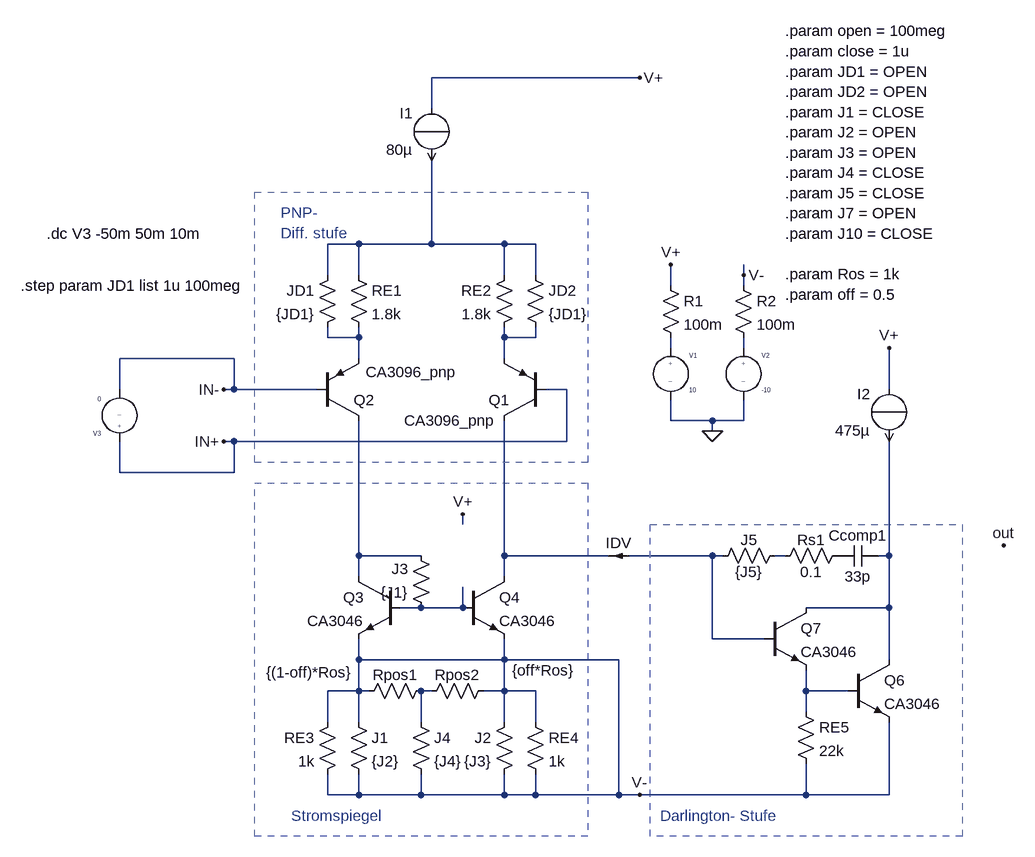
[diagram p0: schematic Diff+spiegel.asc]
Diff+spiegel.asc, the LTspice schematic file:
Version 4
SHEET 1 964 680
WIRE 112 -560 -208 -560
WIRE -208 -512 -208 -560
WIRE -320 -304 -368 -304
WIRE -208 -304 -208 -432
WIRE -208 -304 -320 -304
WIRE -96 -304 -208 -304
WIRE -48 -304 -96 -304
WIRE -368 -256 -368 -304
WIRE -320 -256 -320 -304
WIRE -96 -256 -96 -304
WIRE -48 -256 -48 -304
WIRE 272 -256 272 -272
WIRE 160 -240 160 -272
WIRE 272 -240 272 -256
WIRE -368 -160 -368 -176
WIRE -320 -160 -320 -176
WIRE -320 -160 -368 -160
WIRE -96 -160 -96 -176
WIRE -48 -160 -48 -176
WIRE -48 -160 -96 -160
WIRE 160 -144 160 -160
WIRE 272 -144 272 -160
WIRE -512 -128 -688 -128
WIRE -320 -128 -320 -160
WIRE -96 -128 -96 -160
WIRE -688 -80 -688 -128
WIRE -512 -80 -512 -128
WIRE -512 -80 -528 -80
WIRE -384 -80 -512 -80
WIRE 0 -80 -32 -80
WIRE 496 -80 496 -144
WIRE 160 -32 160 -64
WIRE 224 -32 160 -32
WIRE 272 -32 272 -64
WIRE 272 -32 224 -32
WIRE 224 -16 224 -32
WIRE -512 0 -528 0
WIRE 0 0 0 -80
WIRE 0 0 -512 0
WIRE -688 48 -688 0
WIRE -512 48 -512 0
WIRE -512 48 -688 48
WIRE -160 128 -160 112
WIRE -320 176 -320 -32
WIRE -224 176 -320 176
WIRE -96 176 -96 -32
WIRE 64 176 -96 176
WIRE 224 176 96 176
WIRE 240 176 224 176
WIRE 336 176 320 176
WIRE 496 176 496 0
WIRE 496 176 480 176
WIRE -320 208 -320 176
WIRE -96 208 -96 176
WIRE -224 256 -256 256
WIRE -160 256 -160 224
WIRE -160 256 -224 256
WIRE 496 256 496 176
WIRE 496 256 368 256
WIRE 224 304 224 176
WIRE 304 304 224 304
WIRE -320 336 -320 304
WIRE -96 336 -96 304
WIRE -96 336 -320 336
WIRE 80 336 -96 336
WIRE 496 336 496 256
WIRE -320 384 -320 336
WIRE -320 384 -368 384
WIRE -304 384 -320 384
WIRE -208 384 -224 384
WIRE -96 384 -96 336
WIRE -96 384 -128 384
WIRE -48 384 -96 384
WIRE 368 384 368 352
WIRE 432 384 368 384
WIRE 368 416 368 384
WIRE -368 432 -368 384
WIRE -320 432 -320 384
WIRE -224 432 -224 384
WIRE -96 432 -96 384
WIRE -48 432 -48 384
WIRE -368 544 -368 512
WIRE -320 544 -320 512
WIRE -320 544 -368 544
WIRE -224 544 -224 512
WIRE -224 544 -320 544
WIRE -96 544 -96 512
WIRE -96 544 -224 544
WIRE -48 544 -48 512
WIRE -48 544 -96 544
WIRE 80 544 80 336
WIRE 80 544 -48 544
WIRE 112 544 80 544
WIRE 368 544 368 496
WIRE 368 544 112 544
WIRE 496 544 496 432
WIRE 496 544 368 544
FLAG -160 112 V+
FLAG -528 -80 IN-
FLAG -528 0 IN+
FLAG 112 -560 V+
FLAG 112 544 V-
FLAG 224 -16 0
FLAG 160 -272 V+
FLAG 272 -256 V-
FLAG 496 -144 V+
FLAG 672 160 out
SYMBOL EIT_Semiconductors\\pnp -32 -32 R180
WINDOW 3 77 0 Left 2
SYMATTR Value CA3096_pnp
SYMATTR InstName Q1
SYMBOL EIT_Semiconductors\\pnp -384 -32 M180
WINDOW 3 75 75 Left 2
SYMATTR Value CA3096_pnp
SYMATTR InstName Q2
SYMBOL res -336 -272 R0
SYMATTR InstName RE1
SYMATTR Value 1.8k
SYMBOL res -80 -272 M0
SYMATTR InstName RE2
SYMATTR Value 1.8k
SYMBOL res -352 -272 M0
SYMATTR InstName JD1
SYMATTR Value {JD1}
SYMBOL res -64 -272 R0
SYMATTR InstName JD2
SYMATTR Value {JD1}
SYMBOL EIT_Semiconductors\\npn -256 208 M0
SYMATTR InstName Q3
SYMATTR Value CA3046
SYMBOL EIT_Semiconductors\\npn -160 208 R0
SYMATTR InstName Q4
SYMATTR Value CA3046
SYMBOL res -208 368 R90
WINDOW 0 7 56 VBottom 2
WINDOW 3 -28 188 VTop 2
SYMATTR InstName Rpos1
SYMATTR Value {(1-off)*Ros}
SYMBOL res -336 416 R0
SYMATTR InstName J1
SYMATTR Value {J2}
SYMBOL res -80 416 M0
SYMATTR InstName J2
SYMATTR Value {J3}
SYMBOL res -352 416 M0
SYMATTR InstName RE3
SYMATTR Value 1k
SYMBOL res -64 416 R0
SYMATTR InstName RE4
SYMATTR Value 1k
SYMBOL res -208 272 R180
WINDOW 0 36 76 Left 2
WINDOW 3 36 40 Left 2
SYMATTR InstName J3
SYMATTR Value {J1}
SYMBOL res -112 368 R90
WINDOW 0 7 56 VBottom 2
WINDOW 3 -31 -76 VTop 2
SYMATTR InstName Rpos2
SYMATTR Value {off*Ros}
SYMBOL res -240 416 R0
SYMATTR InstName J4
SYMATTR Value {J4}
SYMBOL source-I -208 -432 R180
WINDOW 0 29 73 Left 2
WINDOW 3 29 17 Left 2
WINDOW 123 0 0 Left 2
WINDOW 39 0 0 Left 2
SYMATTR InstName I1
SYMATTR Value 80µ
SYMBOL source-V 160 -160 R0
WINDOW 123 0 0 Left 2
WINDOW 39 0 0 Left 2
SYMATTR InstName V1
SYMATTR Value 10
SYMBOL source-V 272 -160 R0
WINDOW 123 0 0 Left 2
WINDOW 39 0 0 Left 2
SYMATTR InstName V2
SYMATTR Value -10
SYMBOL source-V -688 16 R180
WINDOW 123 0 0 Left 2
WINDOW 39 0 0 Left 2
SYMATTR InstName V3
SYMATTR Value 0
SYMBOL res 144 -256 R0
SYMATTR InstName R1
SYMATTR Value 100m
SYMBOL res 256 -256 R0
SYMATTR InstName R2
SYMATTR Value 100m
SYMBOL res 224 192 R270
WINDOW 0 25 56 VTop 2
WINDOW 3 7 56 VBottom 2
SYMATTR InstName J5
SYMATTR Value {J5}
SYMBOL cap 480 160 R90
WINDOW 0 0 32 VBottom 2
WINDOW 3 32 32 VTop 2
SYMATTR InstName Ccomp1
SYMATTR Value 33p
SYMBOL EIT_Semiconductors\\npn 432 336 R0
SYMATTR InstName Q6
SYMATTR Value CA3046
SYMBOL EIT_Semiconductors\\npn 304 256 R0
SYMATTR InstName Q7
SYMATTR Value CA3046
SYMBOL res 352 400 R0
SYMATTR InstName RE5
SYMATTR Value 22k
SYMBOL res 432 160 R90
WINDOW 0 7 56 VBottom 2
WINDOW 3 25 56 VTop 2
SYMATTR InstName Rs1
SYMATTR Value 0.1
SYMBOL source-I 496 0 R180
WINDOW 0 29 73 Left 2
WINDOW 3 29 17 Left 2
WINDOW 123 0 0 Left 2
WINDOW 39 0 0 Left 2
SYMATTR InstName I2
SYMATTR Value 475µ
SYMBOL MDB_sym\\arrow_curr 80 176 R90
WINDOW 0 -4 0 VBottom 2
SYMATTR InstName IDV
SYMATTR Value2 Rsh=1
TEXT -440 -352 Left 2 ;PNP-\nDiff. stufe
TEXT -424 576 Left 2 ;Stromspiegel
TEXT 336 -632 Left 2 !.param open = 100meg\n.param close = 1u\n.param JD1 = OPEN\n.param JD2 = OPEN\n.param J1 = CLOSE\n.param J2 = OPEN\n.param J3 = OPEN\n.param J4 = CLOSE\n.param J5 = CLOSE\n.param J7 = OPEN\n.param J10 = CLOSE\n \n.param Ros = 1k\n.param off = 0.5
TEXT -800 -320 Left 2 !.dc V3 -50m 50m 10m
TEXT -840 -240 Left 2 !.step param JD1 list 1u 100meg
TEXT 144 576 Left 2 ;Darlington- Stufe
RECTANGLE Normal 32 32 -480 -384 2
RECTANGLE Normal 32 608 -480 64 2
RECTANGLE Normal 608 608 128 128 2

The netlist it stands for:
* Diff+spiegel.asc
Q1 N007 IN+ N003 0 CA3096_pnp
Q2 N006 IN- N002 0 CA3096_pnp
RE1 N001 N002 1.8k
RE2 N001 N003 1.8k
R§JD1 N001 N002 {JD1}
R§JD2 N001 N003 {JD1}
Q3 N006 N011 V- 0 CA3046
Q4 N007 N011 V- 0 CA3046
Rpos1 N012 V- {(1-off)*Ros}
R§J1 V- V- {J2}
R§J2 V- V- {J3}
RE3 V- V- 1k
RE4 V- V- 1k
R§J3 N011 N006 {J1}
Rpos2 V- N012 {off*Ros}
R§J4 N012 V- {J4}
I1 V+ N001 80µ
V1 N004 0 10
V2 N005 0 -10
V3 IN+ IN- 0
R1 V+ N004 100m
R2 V- N005 100m
R§J5 N008 N009 {J5}
Ccomp1 N010 P001 33p
Q6 N010 N013 V- 0 CA3046
Q7 N010 N008 N013 0 CA3046
RE5 N013 V- 22k
Rs1 P001 N009 0.1
I2 V+ N010 475µ
R§IDV N008 N007 100e-6 Rsh=1
.model NPN NPN
.model PNP PNP
.lib standard.bjt
* PNP-
* Diff. stufe
* Stromspiegel
.param open = 100meg
.param close = 1u
.param JD1 = OPEN
.param JD2 = OPEN
.param J1 = CLOSE
.param J2 = OPEN
.param J3 = OPEN
.param J4 = CLOSE
.param J5 = CLOSE
.param J7 = OPEN
.param J10 = CLOSE
.param Ros = 1k
.param off = 0.5
.dc V3 -50m 50m 10m
.step param JD1 list 1u 100meg
* Darlington- Stufe
.backanno
.end